# EAGLE schematic nrf5340_qkaa_Config3 (EAGLE 9.7.0)
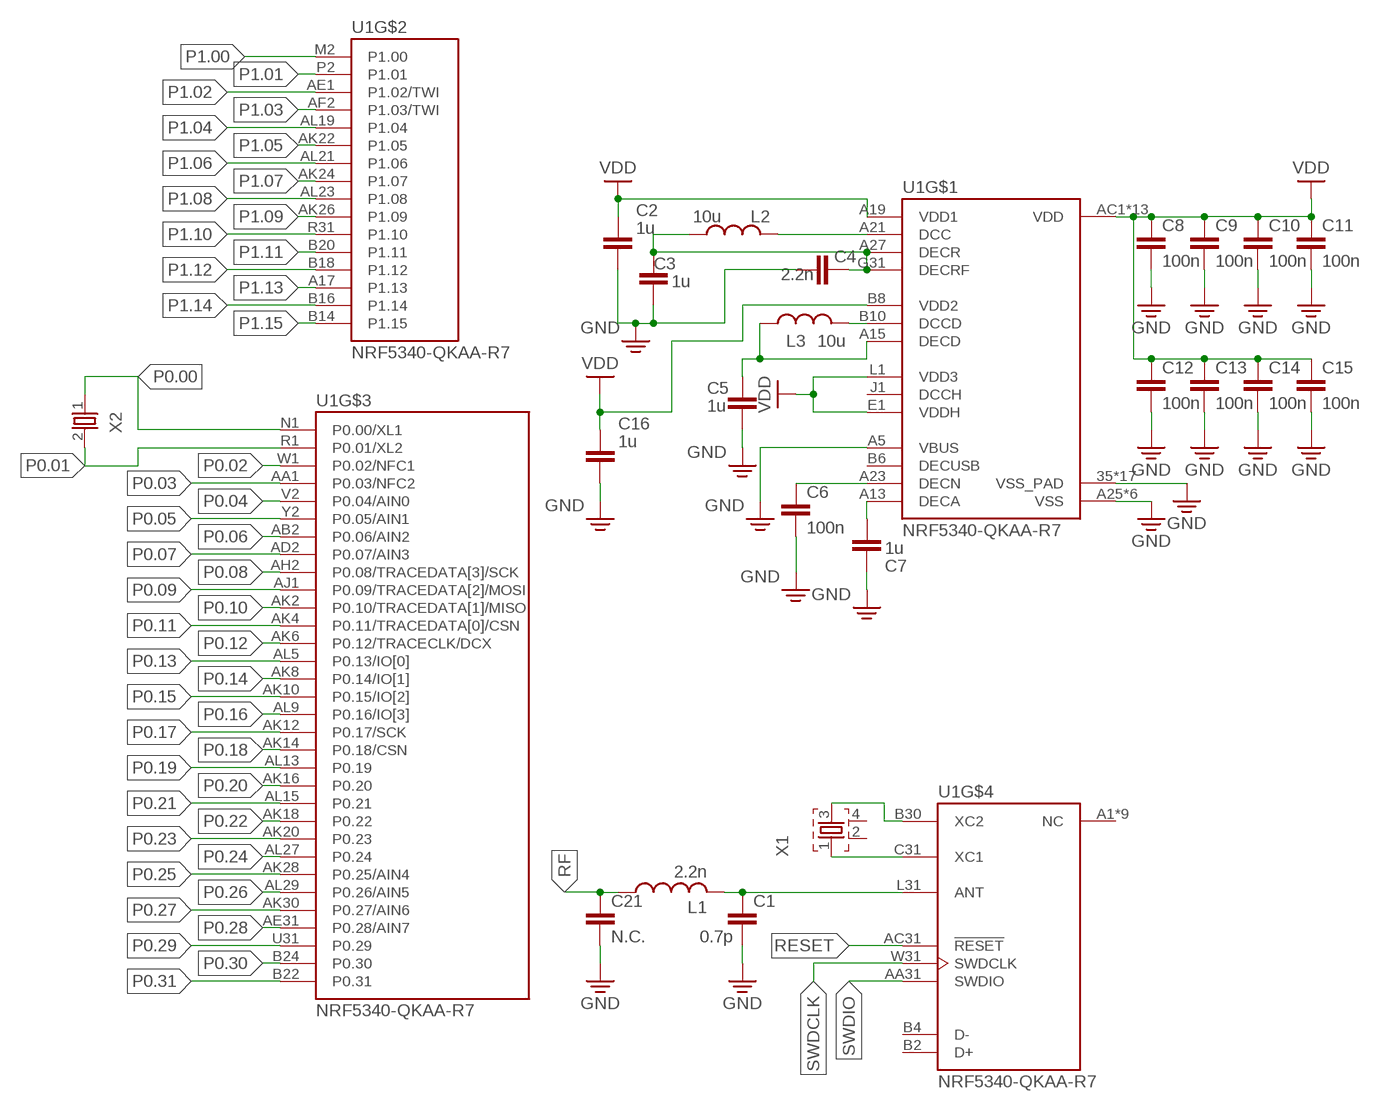
[diagram p0: schematic, sheet 1]

## Parts
C1  0.7p  CAPACITOR_0201_N  [RESC0201_N]
C2  1u  C_CHIP-0402(1005-METRIC)  [CAPC1005X60]
C3  1u  C_CHIP-0402(1005-METRIC)  [CAPC1005X60]
C4  2.2n  CAPACITOR_0201_N  [RESC0201_N]
C5  1u  C_CHIP-0402(1005-METRIC)  [CAPC1005X60]
C6  100n  CAPACITOR_0201_N  [RESC0201_N]
C7  1u  C_CHIP-0402(1005-METRIC)  [CAPC1005X60]
C8  100n  CAPACITOR_0201_N  [RESC0201_N]
C9  100n  CAPACITOR_0201_N  [RESC0201_N]
C10  100n  CAPACITOR_0201_N  [RESC0201_N]
C11  100n  CAPACITOR_0201_N  [RESC0201_N]
C12  100n  CAPACITOR_0201_N  [RESC0201_N]
C13  100n  CAPACITOR_0201_N  [RESC0201_N]
C14  100n  CAPACITOR_0201_N  [RESC0201_N]
C15  100n  CAPACITOR_0201_N  [RESC0201_N]
C16  1u  C_CHIP-0402(1005-METRIC)  [CAPC1005X60]
C21  N.C.  CAPACITOR_0201_N  [RESC0201_N]
L1  2.2n  INDUCTOR_0201_N  [RESC0201_N]
L2  10u  L_CHIP-0603(1608-METRIC)  [INDC1608X95N]
L3  10u  L_CHIP-0603(1608-METRIC)  [INDC1608X95N]
U1  NRF5340-QKAA-R7  [XCVR_NRF5340-QKAA-R7]
X1  XTAL_32MHZ  [BT-XTAL_2016_N]
X2  XTAL_32KHZ  [XTAL_3215_N]

## Nets
GND: C1.2 C2.2 C3.2 C4.2 C5.2 C6.2 C7.2 C8.2 C9.2 C10.2 C11.2 C12.2 C13.2 C14.2 C15.2 C16.2 C21.2 U1.35(VSS_PAD) U1.36(VSS_PAD) U1.37(VSS_PAD) U1.38(VSS_PAD) U1.39(VSS_PAD) U1.40(VSS_PAD) U1.41(VSS_PAD) U1.43(VSS_PAD) U1.44(VSS_PAD) U1.45(VSS_PAD) U1.46(VSS_PAD) U1.47(VSS_PAD) U1.48(VSS_PAD) U1.49(VSS_PAD) U1.50(VSS_PAD) U1.51(VSS_PAD) U1.104(VSS_PAD) U1.A5(VBUS) U1.A25(VSS) U1.B12(VSS) U1.B26(VSS) U1.G1(VSS) U1.H2(VSS) U1.J31(VSS)
N$1: C1.1 L1.2 U1.L31(ANT)
N$2: U1.C31(XC1) X1.1
N$3: U1.B30(XC2) X1.3
N$4: C6.1 U1.A23(DECN)
N$5: L2.2 U1.A21(DCC)
N$6: L3.2 U1.B10(DCCD)
N$7: C5.1 L3.1 U1.A15(DECD)
N$8: C3.1 C4.1 L2.1 U1.A27(DECR) U1.G31(DECRF)
N$9: C7.1 U1.A13(DECA)
P0.00: U1.N1(P0.00/XL1) X2.1
P0.01: U1.R1(P0.01/XL2) X2.2
P0.02: U1.W1(P0.02/NFC1)
P0.03: U1.AA1(P0.03/NFC2)
P0.04: U1.V2(P0.04/AIN0)
P0.05: U1.Y2(P0.05/AIN1)
P0.06: U1.AB2(P0.06/AIN2)
P0.07: U1.AD2(P0.07/AIN3)
P0.08: U1.AH2(P0.08/TRACEDATA[3]/SCK)
P0.09: U1.AJ1(P0.09/TRACEDATA[2]/MOSI)
P0.10: U1.AK2(P0.10/TRACEDATA[1]/MISO)
P0.11: U1.AK4(P0.11/TRACEDATA[0]/CSN)
P0.12: U1.AK6(P0.12/TRACECLK/DCX)
P0.13: U1.AL5(P0.13/IO[0])
P0.14: U1.AK8(P0.14/IO[1])
P0.15: U1.AK10(P0.15/IO[2])
P0.16: U1.AL9(P0.16/IO[3])
P0.17: U1.AK12(P0.17/SCK)
P0.18: U1.AK14(P0.18/CSN)
P0.19: U1.AL13(P0.19)
P0.20: U1.AK16(P0.20)
P0.21: U1.AL15(P0.21)
P0.22: U1.AK18(P0.22)
P0.23: U1.AK20(P0.23)
P0.24: U1.AL27(P0.24)
P0.25: U1.AK28(P0.25/AIN4)
P0.26: U1.AL29(P0.26/AIN5)
P0.27: U1.AK30(P0.27/AIN6)
P0.28: U1.AE31(P0.28/AIN7)
P0.29: U1.U31(P0.29)
P0.30: U1.B24(P0.30)
P0.31: U1.B22(P0.31)
P1.00: U1.M2(P1.00)
P1.01: U1.P2(P1.01)
P1.02: U1.AE1(P1.02/TWI)
P1.03: U1.AF2(P1.03/TWI)
P1.04: U1.AL19(P1.04)
P1.05: U1.AK22(P1.05)
P1.06: U1.AL21(P1.06)
P1.07: U1.AK24(P1.07)
P1.08: U1.AL23(P1.08)
P1.09: U1.AK26(P1.09)
P1.10: U1.R31(P1.10)
P1.11: U1.B20(P1.11)
P1.12: U1.B18(P1.12)
P1.13: U1.A17(P1.13)
P1.14: U1.B16(P1.14)
P1.15: U1.B14(P1.15)
RESET: U1.AC31(!RESET)
RF: C21.1 L1.1
SWDCLK: U1.W31(SWDCLK)
SWDIO: U1.AA31(SWDIO)
VDD: C2.1 C8.1 C9.1 C10.1 C11.1 C12.1 C13.1 C14.1 C15.1 C16.1 U1.A19(VDD1) U1.AC1(VDD) U1.AG1(VDD) U1.AJ31(VDD) U1.AL3(VDD) U1.AL7(VDD) U1.AL11(VDD) U1.AL17(VDD) U1.AL25(VDD) U1.B8(VDD2) U1.B28(VDD) U1.C1(VDD) U1.E1(VDDH) U1.E31(VDD) U1.L1(VDD3) U1.N31(VDD) U1.U1(VDD)
Unconnected: U1.A1(NC) U1.A31(NC) U1.AG31(NC) U1.AL1(NC) U1.AL31(NC) U1.B2(D+) U1.B4(D-) U1.D2(NC) U1.F2(NC) U1.K2(NC) U1.T2(NC) X1.2 X1.4

## Power pins joined to a net without a drawn wire
DCCH: U1.J1(DCCH)
DECUSB: U1.B6(DECUSB)

## Library data of the parts
C1 C4 C6 C8-C15 C21 = ChronosV5 v10:CAPACITOR: Generic chip capacitor
C2 C3 C5 C7 C16 = ChronosV5 v10:C: Capacitor - Generic; CATEGORY: Capacitor
L1 = ChronosV5 v10:INDUCTOR: Generic chip inductor
L2 L3 = Inductor:L: Inductor Fixed - Generic; CATEGORY: Inductor; SUB-CATEGORY: Fixed
U1 = NRF5340-QKAA-R7:NRF5340-QKAA-R7; MANUFACTURER: Nordic Semiconductor; MAXIMUM_PACKAGE_HEIGHT: 0.85mm; PARTREV: 1.0; STANDARD: Manufacturer Recommendations
X1 = Nordic_nRF:XTAL_32MHZ
X2 = Nordic_nRF:XTAL_32KHZ